# Altium schematic sheet LedMatrixPixel.SchDoc
size A4
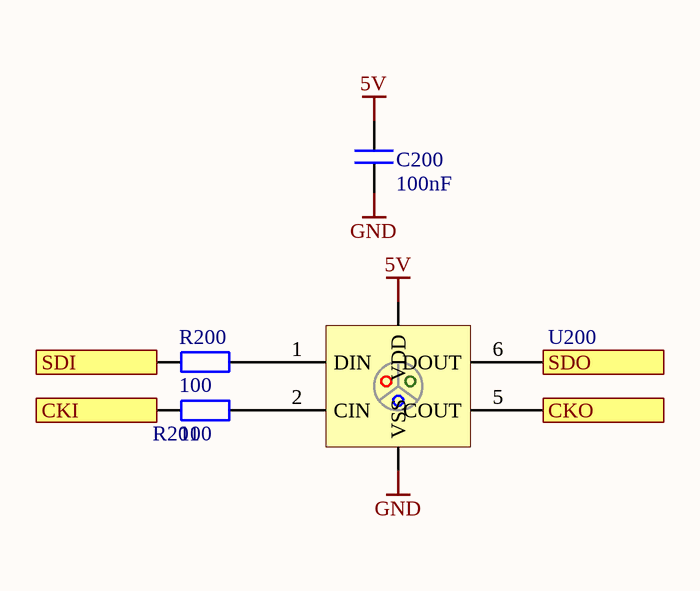
[diagram p0: LedMatrixPixel.SchDoc]

## Parts
C200  100nF  [CAP1608X06M]
R200  100  [RESC1608X06M]
R201  100  [RESC1608X06M]
U200  APA102-2020  [APA102]  (value not drawn)

## Ports
CKI (in), CKO (out), SDI (in), SDO (out)

## Nets
5V: C200.2 U200.4(VDD)
GND: C200.1 U200.3(VSS)
CKI: R201.1 ; port CKI
CKO: U200.5(COUT) ; port CKO
SDI: R200.1 ; port SDI
SDO: U200.6(DOUT) ; port SDO
NetR200_2: R200.2 U200.1(DIN)
NetR201_2: R201.2 U200.2(CIN)

## Library data of the parts
C200 = Capacitor 100n: Value: 100nF
R200 R201 = Resistor 100: Value: 100
U200 = APA102-2020: RGB LED